# Altium schematic sheet FPGA_Config.SchDoc
size A2
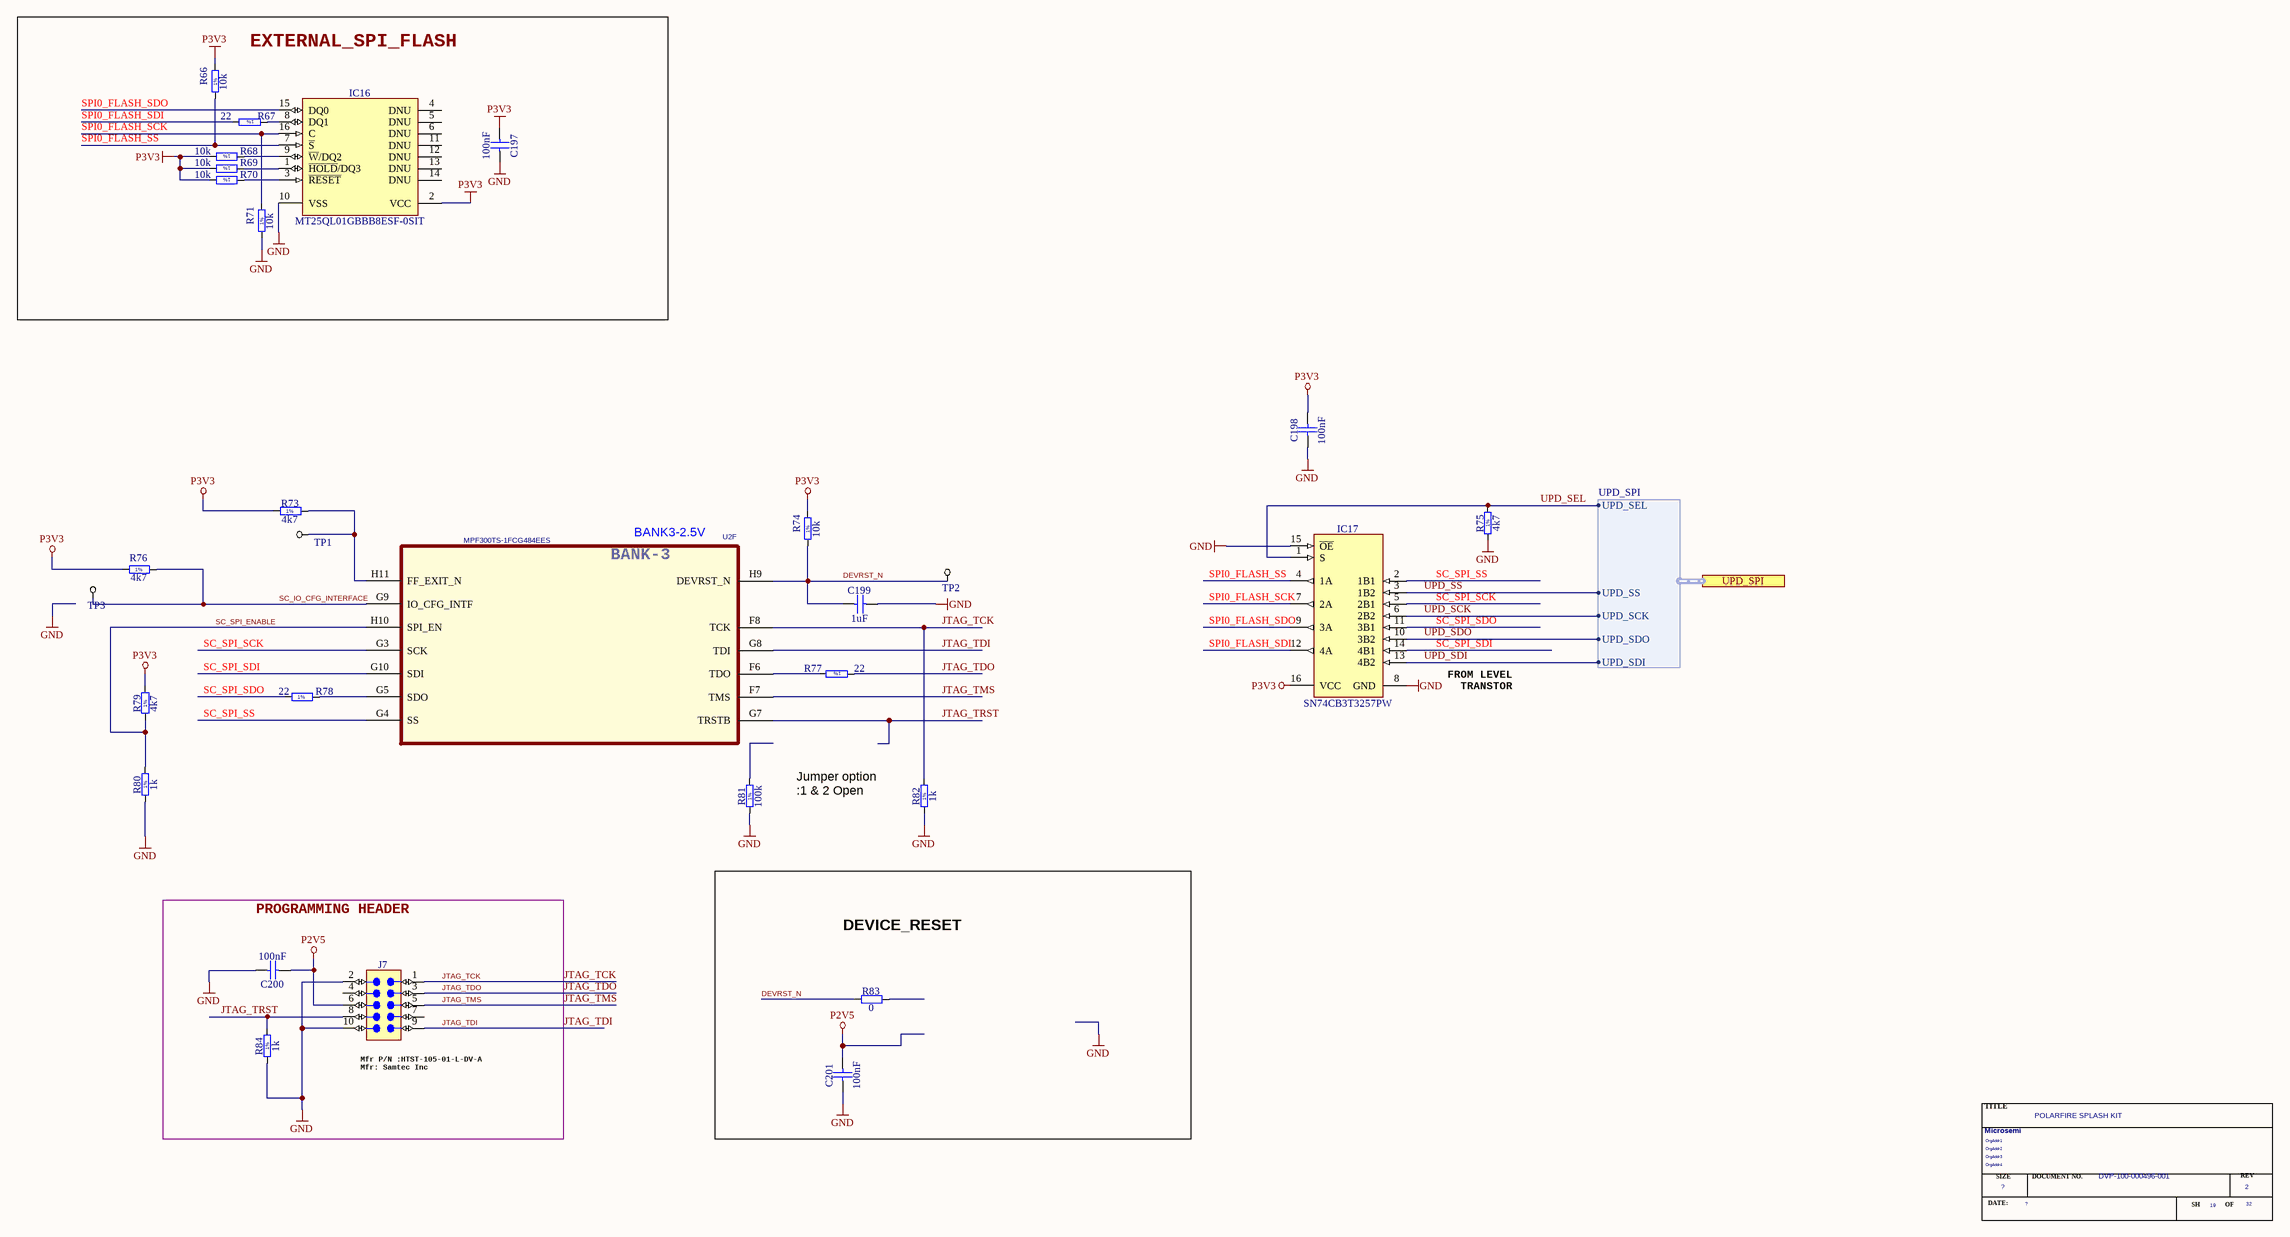
[diagram p0: FPGA_Config.SchDoc]

## Parts
*?  RevCode: 2  Title: POLARFIRE SPLASH KIT  OrgName: Microsemi  Page Number: 19  Page Count: 32  Doc: DVP-100-000496-001  (hidden comment: bayside_blk)  (graphical)
C197  100nF  [CAPC0603X33N]
C198  100nF  [CAPC0603X33N]
C199  1uF  [CAPC1005X55N]
C200  100nF  [CAPC0603X33N]
C201  100nF  [CAPC0603X33N]
IC16  MT25QL01GBBB8ESF-0SIT  [SOIC127P1030X265-16N]
IC17  SN74CB3T3257PW  [SOP65P640X120-16N]
J7  C-Grid®  [MOLEX_70246-1004]  (value not drawn)
R66  10k  [RESC1005X40N]
R67  22  [RESC1005X40N]
R68  10k  [RESC1005X40N]
R69  10k  [RESC1005X40N]
R70  10k  [RESC1005X40N]
R71  10k  [RESC1005X40N]
R73  4k7  [RESC1005X40N]
R74  10k  [RESC1005X40N]
R75  4k7  [RESC1005X40N]
R76  4k7  [RESC1005X40N]
R77  22  [RESC1005X40N]
R78  22  [RESC1005X40N]
R79  4k7  [RESC1005X40N]
R80  1k  [RESC1005X40N]
R81  100k  [RESC1005X40N]
R82  1k  [RESC1005X40N]
R83  0  [RESC1005X40N]
R84  1k  [RESC1005X40N]
TP1  TP  [TP_large]  (value not drawn)
TP2  TP  [TP_large]  (value not drawn)
TP3  TP  [TP_large]  (value not drawn)
U2  MPF300TS-1FCG484EES  [BGA484C100P22X22_2300X2300X320]  (part F of 11)

## Blocks framed on the sheet
EXTERNAL_SPI_FLASH: C197 IC16 R66-R71
DEVICE_RESET: C201 R83
PROGRAMMING HEADER: C200 J7 R84

## Ports
UPD_SPI (harness UPD_SPI)

## Harnesses
UPD_SPI: UPD_SEL, UPD_SS, UPD_SCK, UPD_SDO, UPD_SDI

## Nets
GND: C197.1 C198.1 C199.2 C200.2 C201.1 IC16.10(VSS) IC17.8(GND) IC17.15(~{OE}) J7.2 J7.10 R71.1 R75.1 R80.1 R81.1 R82.1 R84.1
P2V5: C200.1 C201.2 J7.6
P3V3: C197.2 C198.2 IC16.2(VCC) IC17.16(VCC) R66.2 R68.2 R69.2 R70.2 R73.1 R74.2 R76.1 R79.1
DEVRST_N: C199.1 R74.1 R83.1 TP2.1 U2.H9(DEVRST_N)
JTAG_TCK: J7.1 R82.2 U2.F8(TCK)
JTAG_TDI: J7.9 U2.G8(TDI)
JTAG_TDO: J7.3 R77.1
JTAG_TMS: J7.5 U2.F7(TMS)
JTAG_TRST: J7.8 R84.2 U2.G7(TRSTB)
SC_IO_CFG_INTERFACE: R76.2 TP3.1 U2.G9(IO_CFG_INTF)
SC_SPI_ENABLE: R79.2 R80.2 U2.H10(SPI_EN)
SC_SPI_SCK: IC17.5(2B1) U2.G3(SCK)
SC_SPI_SDI: IC17.14(4B1) U2.G10(SDI)
SC_SPI_SDO: IC17.11(3B1) R78.1
SC_SPI_SS: IC17.2(1B1) U2.G4(SS)
SPI0_FLASH_SCK: IC16.16(C) IC17.7(2A) R71.2
SPI0_FLASH_SDI: IC17.12(4A) R67.2
SPI0_FLASH_SDO: IC16.15(DQ0) IC17.9(3A)
SPI0_FLASH_SS: IC16.7(~{S}) IC17.4(1A) R66.1
UPD_SCK: IC17.6(2B2) ; port UPD_SPI.UPD_SCK
UPD_SDI: IC17.13(4B2) ; port UPD_SPI.UPD_SDI
UPD_SDO: IC17.10(3B2) ; port UPD_SPI.UPD_SDO
UPD_SEL: IC17.1(S) R75.2 ; port UPD_SPI.UPD_SEL
UPD_SS: IC17.3(1B2) ; port UPD_SPI.UPD_SS
NetIC16_1: IC16.1(~{HOLD}/DQ3) R69.1
NetIC16_3: IC16.3(~{RESET}) R70.1
NetIC16_8: IC16.8(DQ1) R67.1
NetIC16_9: IC16.9(~{W}/DQ2) R68.1
NetR73_2: R73.2 TP1.1 U2.H11(FF_EXIT_N)
NetR77_2: R77.2 U2.F6(TDO)
NetR78_2: R78.2 U2.G5(SDO)

Not connected (* = marked no-connect by the designer): IC16 4(DNU) 5(DNU) 6(DNU) 11(DNU) 12(DNU) 13(DNU) 14(DNU); J7 4 7; R81 2; R83 2

## Notes on the sheet
- (near U2) BANK3-2.5V
- FROM LEVEL
  TRANSTOR
- (near R82) Jumper option
  :1 & 2 Open
- (near J7) Mfr P/N :HTST-105-01-L-DV-A
  Mfr: Samtec Inc
- (in symbol bayside_blk) TITLE; SIZE; DOCUMENT NO.; REV; DATE:; SH; OF
- (in symbol FPGA_MPF300T-FCG484, part F) BANK-3
- (in symbol R0402_1K_1%_0.0625W_100PPM) 1%
- (in symbol R0402_4K7_1%_0.0625W_100PPM) 1%
- (in symbol R0402_10K_1%_0.0625W_100PPM) 1%
- (in symbol R0402_22R_1%_0.0625W_100PPM) 1%
- (in symbol R0402_100K_1%_0.0625W_100PPM) 1%

## Library data of the parts
C197 C200 C201 = CC0201_100NF_6.3V_10%_X5R: Non-polarised capacitor; Manufacturer: GENERIC; Part Description: SMD Multilayer Chip Ceramic Capacitor; Manufacturer1 Part Number: 02016D104KAT2A; Voltage: 6.3V; TC: X5R; Tolerance: ±10%; Part Number: CC0201_100NF_6.3V_10%_X5R; Component Kind: Standard; Component Type: Standard; Pin Count: 2; Value: 100nF; Status: Not Recommended; Manufacturer Part Number: CC0201_100NF_6.3V_10%_X5R; Case: 0201; Mounted: Yes; Socket: No; SMD: Yes; Sense: No; Manufacturer1 Example: AVX; Manufacturer1 ComponentHeight: 0.33mm; HelpURL: \\cern.ch\dfs\Applications\Altium\Datasheets\CC0201_X5R_AVX.pdf; Author: CERN DEM JLC; CreateDate: 03/12/2007; LatestRevisionDate: 03/12/2007
C198 = CC0201_100NF_6.3V_10%_X5R: Non-polarised capacitor; Manufacturer: GENERIC; Part Description: SMD Multilayer Chip Ceramic Capacitor; Manufacturer1 Part Number: 02016D104KAT2A; Tolerance: ±10%; Voltage: 6.3V; TC: X5R; Part Number: CC0201_100NF_6.3V_10%_X5R; Component Kind: Standard; Component Type: Standard; Pin Count: 2; Value: 100nF; Status: Not Recommended; Manufacturer Part Number: CC0201_100NF_6.3V_10%_X5R; Case: 0201; Mounted: Yes; Socket: No; SMD: Yes; Sense: No; Manufacturer1 Example: AVX; Manufacturer1 ComponentHeight: 0.33mm; HelpURL: \\cern.ch\dfs\Applications\Altium\Datasheets\CC0201_X5R_AVX.pdf; Author: CERN DEM JLC; CreateDate: 03/12/2007; LatestRevisionDate: 03/12/2007
C199 = CC0402_1UF_16V_10%_X5R: Non-polarised capacitor; Part Description: SMD Multilayer Chip Ceramic Capacitor; Manufacturer: GENERIC; Manufacturer1 Part Number: C1005X5R1C105KT; Voltage: 16V; TC: X5R; Tolerance: ±10%; Part Number: CC0402_1UF_16V_10%_X5R; Component Kind: Standard; Component Type: Standard; Pin Count: 2; Value: 1uF; Status: Preferred; Manufacturer Part Number: CC0402_1UF_16V_10%_X5R; Case: 0402; Mounted: Yes; Socket: No; SMD: Yes; Sense: No; Manufacturer1 Example: TDK; Manufacturer1 ComponentHeight: 0.55mm; HelpURL: \\cern.ch\dfs\Applications\Altium\Datasheets\CC0402_X5R_TDK_C.pdf; Author: CERN DEM JLC; CreateDate: 25/10/2012; LatestRevisionDate: 25/10/2012
IC16 = MEM_MT25QL01GBBB8ESF-0SIT: 1Gbit (128MB), 3.3V, Multiple I/O Serial Flash Memory, Reset# & Hold# Pinset# & Hold# Pins; Manufacturer: MICRON TECHNOLOGY; PressFit: No; Bonding: No; Part Number: MT25QL01GBBB8ESF-0SIT; Component Kind: Standard; Component Type: Standard; Device: MT25QL01GBBB8ESF-0SIT; PackageDescription: SOIC 16, Pitch 1.27mm - Body 7.5x10.3mm, IPC Medium Density; Part Description: 1Gbit (128MB), 3.3V, Multiple I/O Serial Flash Memory, Reset# & Hold# Pins; Manufacturer Part Number: MT25QL01GBBB8ESF-0SIT; Pin Count: 16; Case: SOIC16; Mounted: Yes; Socket: No; SMD: Yes; Sense: No; ComponentHeight: 2.65mm; HelpURL: \\cern.ch\dfs\Applications\Altium\Datasheets\MT25QL01GBBB8ESF-0SIT.pdf; Author: CERN DEM MR; CreateDate: 26/01/2018; LatestRevisionDate: 26/01/2018
IC17 = SN74CB3T3257PW: 4-BIT 1-OF-2 FET Multiplexer/Demultiplexer 2.5V/3.3V Low-Voltage Bus Switch 5V Tolerant Shifter; Manufacturer: TEXAS INSTRUMENTS; PressFit: No; Bonding: No; Part Number: SN74CB3T3257PW; Component Kind: Standard; Component Type: Standard; Device: SN74CB3T3257PW; PackageDescription: SOP, 0.65mm pitch; 16 pin, 4.40mm W X 5.00mm L X 1.20mm H body IPC Medium Density; Part Description: 4-Bit 1-of-2 FET Multiplexer/Demultiplexer 2.5V/3.3V Low-Voltage Bus Switch 5V Tolerant Shifter; Manufacturer Part Number: SN74CB3T3257PW; Pin Count: 16; Case: TSSOP16; Mounted: Yes; Socket: No; SMD: Yes; Sense: No; ComponentHeight: 1.2mm; Author: CERN DEM JLC; HelpURL: \\cern.ch\dfs\Applications\Altium\Datasheets\SN74CB3T3257PW.pdf; CreateDate: 30/01/2012; LatestRevisionDate: 30/01/2012
J7 = MOLEX_70246-1004: Connector 10 Male; Part Description: 2.54mm Pitch C-Grid® Header, Low Profile, Dual Row, Vertical, Shrouded Header; Manufacturer: MOLEX; PressFit: No; Part Number: MOLEX_70246-1004; Component Kind: Standard; Component Type: Standard; Pin Count: 10; Family: C-Grid®; Mounted: Yes; Socket: No; SMD: No; Sense: No; Status: None; Manufacturer Part Number: 70246-1004; ComponentHeight: 9.27mm; HelpURL: \\cern.ch\dfs\Applications\Altium\Datasheets\MOLEX_70246-1004.pdf; Author: CERN DEM JLC; CreateDate: 14/08/2013; LatestRevisionDate: 14/08/2013
R66 R68-R71 R74 = R0402_10K_1%_0.0625W_100PPM: Resistor - 1%; Manufacturer: GENERIC; Part Description: General Purpose Thick Film Chip Resistor; Manufacturer1 Part Number: 232270671003L; TC: ±100ppm/°C; PressFit: No; Manufacturer Part Number: R0402_10K_1%_0.0625W_100PPM; Part Number: R0402_10K_1%_0.0625W_100PPM; Tolerance: ±1%; Value: 10k; Component Kind: Standard; Component Type: Standard; Pin Count: 2; Status: Not Recommended; Power: 0.0625W; Case: 0402; Mounted: Yes; Sense: No; Socket: No; SMD: Yes; Manufacturer1 Example: YAGEO PHYCOMP; Manufacturer1 ComponentHeight: 0.4mm; HelpURL: \\cern.ch\dfs\Applications\Altium\Datasheets\R0402_Phycomp_RC0402.pdf; Author: CERN DEM JLC; CreateDate: 03/12/2007; LatestRevisionDate: 17/10/2012
R67 R77 = R0402_22R_1%_0.0625W_100PPM: Resistor - 1%; Manufacturer: GENERIC; Part Description: General Purpose Thick Film Chip Resistor; Manufacturer1 Part Number: 232270672209L; TC: ±100ppm/°C; PressFit: No; Part Number: R0402_22R_1%_0.0625W_100PPM; Component Kind: Standard; Component Type: Standard; Pin Count: 2; Value: 22; Status: Not Recommended; Power: 0.0625W; Tolerance: ±1%; Manufacturer Part Number: R0402_22R_1%_0.0625W_100PPM; Case: 0402; Mounted: Yes; Sense: No; Socket: No; SMD: Yes; Manufacturer1 Example: YAGEO PHYCOMP; Manufacturer1 ComponentHeight: 0.4mm; HelpURL: \\cern.ch\dfs\Applications\Altium\Datasheets\R0402_Phycomp_RC0402.pdf; Author: CERN DEM JLC; CreateDate: 03/12/2007; LatestRevisionDate: 17/10/2012
R73 R75 R76 R79 = R0402_4K7_1%_0.0625W_100PPM: Resistor - 1%; Manufacturer: GENERIC; Part Description: General Purpose Thick Film Chip Resistor; Manufacturer1 Part Number: 232270674702L; TC: ±100ppm/°C; PressFit: No; Part Number: R0402_4K7_1%_0.0625W_100PPM; Component Kind: Standard; Component Type: Standard; Pin Count: 2; Value: 4k7; Status: Not Recommended; Power: 0.0625W; Tolerance: ±1%; Manufacturer Part Number: R0402_4K7_1%_0.0625W_100PPM; Case: 0402; Mounted: Yes; Sense: No; Socket: No; SMD: Yes; Manufacturer1 Example: YAGEO PHYCOMP; Manufacturer1 ComponentHeight: 0.4mm; HelpURL: \\cern.ch\dfs\Applications\Altium\Datasheets\R0402_Phycomp_RC0402.pdf; Author: CERN DEM JLC; CreateDate: 03/12/2007; LatestRevisionDate: 17/10/2012
R78 = R0402_22R_1%_0.0625W_100PPM: Resistor - 1%; Part Description: General Purpose Thick Film Chip Resistor; Manufacturer: GENERIC; Manufacturer1 Part Number: 232270672209L; TC: ±100ppm/°C; PressFit: No; Part Number: R0402_22R_1%_0.0625W_100PPM; Component Kind: Standard; Component Type: Standard; Pin Count: 2; Value: 22; Status: Not Recommended; Power: 0.0625W; Tolerance: ±1%; Manufacturer Part Number: R0402_22R_1%_0.0625W_100PPM; Case: 0402; Mounted: Yes; Sense: No; Socket: No; SMD: Yes; Manufacturer1 Example: YAGEO PHYCOMP; Manufacturer1 ComponentHeight: 0.4mm; HelpURL: \\cern.ch\dfs\Applications\Altium\Datasheets\R0402_Phycomp_RC0402.pdf; Author: CERN DEM JLC; CreateDate: 03/12/2007; LatestRevisionDate: 17/10/2012
R80 R82 R84 = R0402_1K_1%_0.0625W_100PPM: Resistor - 1%; Part Description: General Purpose Thick Film Chip Resistor; Manufacturer: GENERIC; Manufacturer1 Part Number: 232270671002L; TC: ±100ppm/°C; PressFit: No; Part Number: R0402_1K_1%_0.0625W_100PPM; Component Kind: Standard; Component Type: Standard; Pin Count: 2; Value: 1k; Status: Not Recommended; Power: 0.0625W; Tolerance: ±1%; Manufacturer Part Number: R0402_1K_1%_0.0625W_100PPM; Case: 0402; Mounted: Yes; Sense: No; Socket: No; SMD: Yes; Manufacturer1 Example: YAGEO PHYCOMP; Manufacturer1 ComponentHeight: 0.4mm; HelpURL: \\cern.ch\dfs\Applications\Altium\Datasheets\R0402_Phycomp_RC0402.pdf; Author: CERN DEM JLC; CreateDate: 03/12/2007; LatestRevisionDate: 17/10/2012
R81 = R0402_100K_1%_0.0625W_100PPM: Resistor - 1%; Part Description: General Purpose Thick Film Chip Resistor; Manufacturer: GENERIC; Manufacturer1 Part Number: 232270671004L; TC: ±100ppm/°C; PressFit: No; Part Number: R0402_100K_1%_0.0625W_100PPM; Component Kind: Standard; Component Type: Standard; Pin Count: 2; Value: 100k; Status: Not Recommended; Power: 0.0625W; Tolerance: ±1%; Manufacturer Part Number: R0402_100K_1%_0.0625W_100PPM; Case: 0402; Mounted: Yes; Sense: No; Socket: No; SMD: Yes; Manufacturer1 Example: YAGEO PHYCOMP; Manufacturer1 ComponentHeight: 0.4mm; HelpURL: \\cern.ch\dfs\Applications\Altium\Datasheets\R0402_Phycomp_RC0402.pdf; Author: CERN DEM JLC; CreateDate: 03/12/2007; LatestRevisionDate: 17/10/2012
R83 = R0402_0R_JUMPER: Resistor; Part Description: 1A (0.05R Max DC Resistance) Zero Ohm Jumper; Manufacturer: GENERIC; Manufacturer1 Part Number: 232270591001L; PressFit: No; Part Number: R0402_0R_JUMPER; Component Kind: Standard; Component Type: Standard; Pin Count: 2; Value: 0; Status: Not Recommended; Manufacturer Part Number: R0402_0R_JUMPER; Case: 0402; Mounted: Yes; Sense: No; Socket: No; SMD: Yes; Manufacturer1 Example: YAGEO PHYCOMP; Manufacturer1 ComponentHeight: 0.4mm; HelpURL: \\cern.ch\dfs\Applications\Altium\Datasheets\R0402_Phycomp_RC0402.pdf; Author: CERN DEM JLC; CreateDate: 03/12/2007; LatestRevisionDate: 17/10/2012
TP1-TP3 = TP: Testpoint
U2 = FPGA_MPF300T-FCG484: FCG484,23mmX23mm,1.0mm pitch; Manufacturer: Microsemi; Part Number: MPF300TS-1FCG484I
*? = bayside_blk: OrgAddr4: OrgAddr4; OrgAddr1: OrgAddr1; OrgAddr2: OrgAddr2; OrgAddr3: OrgAddr3; Page Size: ?; Page Modify Date: ?; Project name: POLARFIRE SPLASH KIT